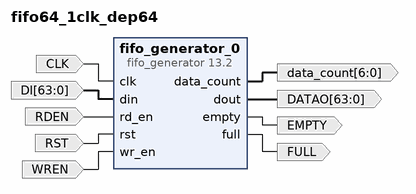
[diagram p0: block diagram of the top level]
# Vivado block design fifo64_1clk_dep64, xc7z045ffg900-2, Vivado 2017.4.1
create_bd_design fifo64_1clk_dep64

create_bd_port -dir I -type clk CLK
set_property -dict {CONFIG.FREQ_HZ 200000000} [get_bd_ports CLK]
create_bd_port -dir I -from 63 -to 0 -type data DI
create_bd_port -dir I RDEN
create_bd_port -dir I -type rst RST
set_property -dict {CONFIG.POLARITY ACTIVE_HIGH} [get_bd_ports RST]
create_bd_port -dir I WREN
create_bd_port -dir O -from 6 -to 0 -type data data_count
create_bd_port -dir O -from 63 -to 0 -type data DATAO
create_bd_port -dir O EMPTY
create_bd_port -dir O FULL

create_bd_cell -type ip -vlnv xilinx.com:ip:fifo_generator:13.2 fifo_generator_0
set_property -dict [list \
  CONFIG.Performance_Options First_Word_Fall_Through \
  CONFIG.Input_Data_Width 64 \
  CONFIG.Input_Depth 64 \
  CONFIG.Output_Data_Width 64 \
  CONFIG.Reset_Type Asynchronous_Reset \
  CONFIG.Full_Flags_Reset_Value 1 \
  CONFIG.Use_Dout_Reset true \
  CONFIG.Underflow_Flag false \
  CONFIG.Data_Count true \
  CONFIG.Data_Count_Width 7 \
] [get_bd_cells fifo_generator_0]

# ---- connections ----

connect_bd_net [get_bd_ports CLK] [get_bd_pins fifo_generator_0/clk]
connect_bd_net [get_bd_ports DI] [get_bd_pins fifo_generator_0/din]
connect_bd_net [get_bd_ports RDEN] [get_bd_pins fifo_generator_0/rd_en]
connect_bd_net [get_bd_ports RST] [get_bd_pins fifo_generator_0/rst]
connect_bd_net [get_bd_ports WREN] [get_bd_pins fifo_generator_0/wr_en]
connect_bd_net [get_bd_pins fifo_generator_0/data_count] [get_bd_ports data_count]
connect_bd_net [get_bd_pins fifo_generator_0/dout] [get_bd_ports DATAO]
connect_bd_net [get_bd_pins fifo_generator_0/empty] [get_bd_ports EMPTY]
connect_bd_net [get_bd_pins fifo_generator_0/full] [get_bd_ports FULL]

validate_bd_design
save_bd_design
